# EAGLE design POV_V2 (EAGLE 6.5.0)
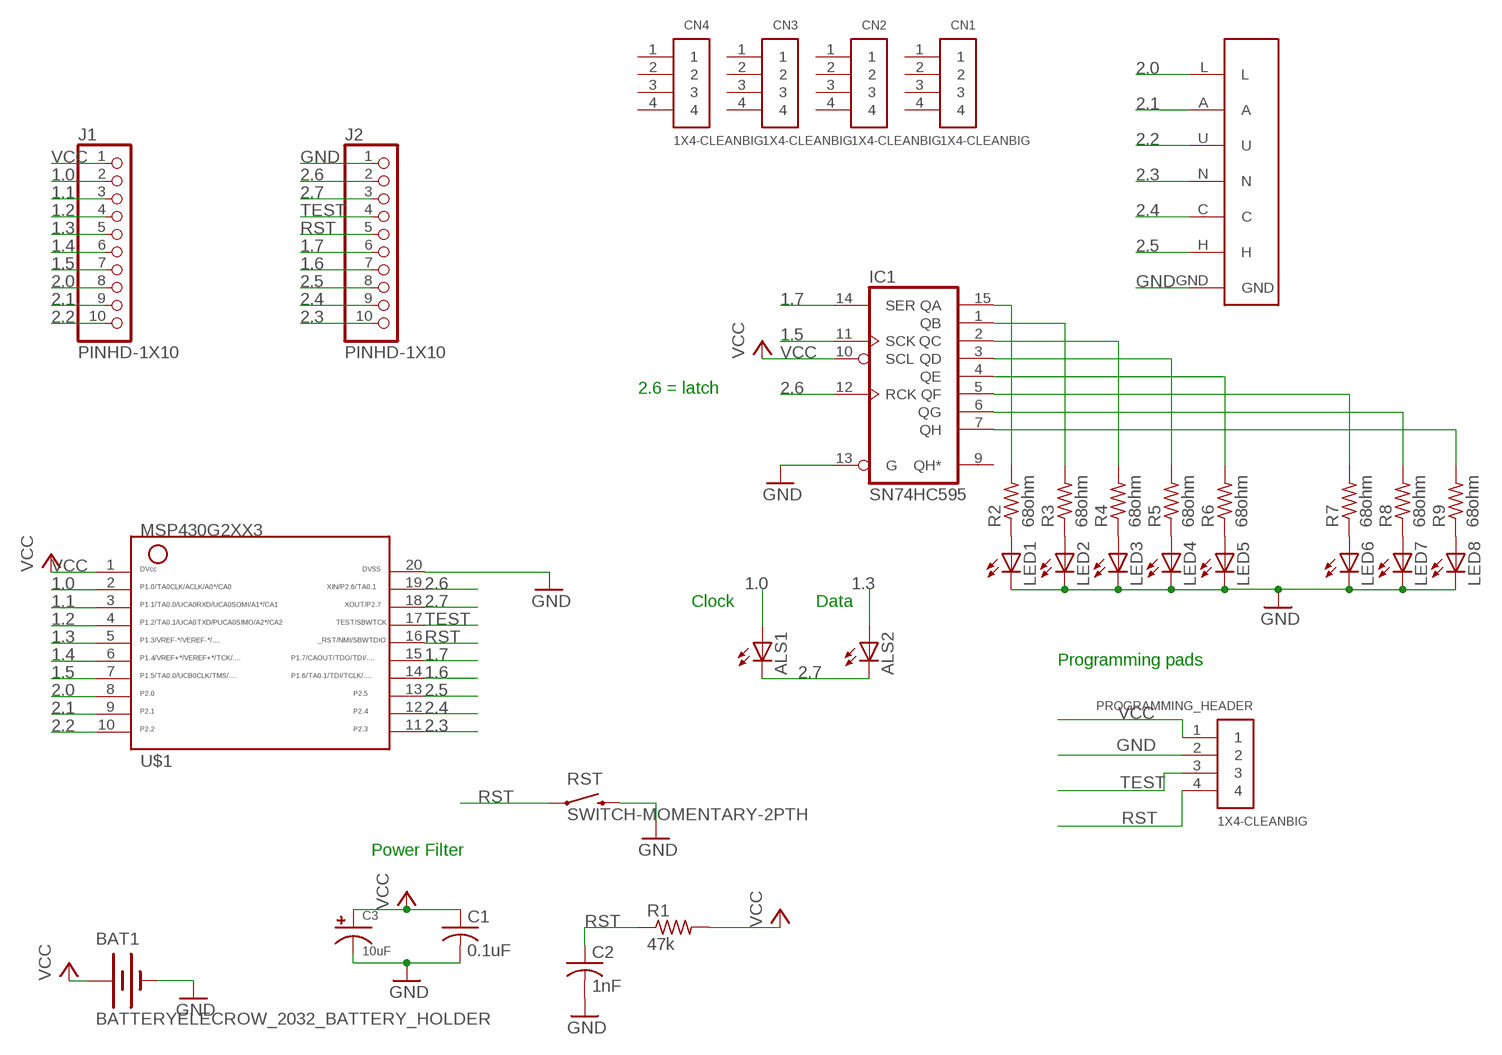
[diagram p0: schematic, sheet 1]

## Parts
ALS1  LED3MM  [LED3MM]
ALS2  LED3MM  [LED3MM]
BAT1  BATTERYELECROW_2032_BATTERY_HOLDER  [BATTCON_20MM_4LEGS]
C1  0.1uF  C-US025-024X044  [C025-024X044]
C2  1nF  C-US025-024X044  [C025-024X044]
C3  10uF  CPOL-US  [E2,5-5]
CN1  1X4-CLEANBIG  [1X04-CLEANBIG]
CN2  1X4-CLEANBIG  [1X04-CLEANBIG]
CN3  1X4-CLEANBIG  [1X04-CLEANBIG]
CN4  1X4-CLEANBIG  [1X04-CLEANBIG]
IC1  SN74HC595  74LS595N  [DIL16]
J1  PINHD-1X10  [1X10-BIG]
J2  PINHD-1X10  [1X10-BIG]
LED1  LED3MM  [LED3MM]
LED2  LED3MM  [LED3MM]
LED3  LED3MM  [LED3MM]
LED4  LED3MM  [LED3MM]
LED5  LED3MM  [LED3MM]
LED6  LED3MM  [LED3MM]
LED7  LED3MM  [LED3MM]
LED8  LED3MM  [LED3MM]
PROGRAMMING_HEADER  1X4-CLEANBIG  [1X04-CLEANBIG]
R1  47k  R-US_0204/7  [0204/7]
R2  68ohm  R-US_0204/7  [0204/7]
R3  68ohm  R-US_0204/7  [0204/7]
R4  68ohm  R-US_0204/7  [0204/7]
R5  68ohm  R-US_0204/7  [0204/7]
R6  68ohm  R-US_0204/7  [0204/7]
R7  68ohm  R-US_0204/7  [0204/7]
R8  68ohm  R-US_0204/7  [0204/7]
R9  68ohm  R-US_0204/7  [0204/7]
RST  SWITCH-MOMENTARY-2PTH  [TACTILE-PTH]
U$1  G2553  G2XX3---N20  [N20]
U$5  LAUNCH_SLIDER  [LAUNCHYOURDESIGN_CAPT_SLIDER]

## Nets
1.0: ALS1.A J1.2 U$1.2
1.1: J1.3 U$1.3
1.2: J1.4 U$1.4
1.3: ALS2.A J1.5 U$1.5
1.4: J1.6 U$1.6
1.5: IC1.11(SCK) J1.7 U$1.7
1.6: J2.7 U$1.14
1.7: IC1.14(SER) J2.6 U$1.15
2.0: J1.8 U$1.8 U$5.L
2.1: J1.9 U$1.9 U$5.A
2.2: J1.10 U$1.10 U$5.U
2.3: J2.10 U$1.11 U$5.N
2.4: J2.9 U$1.12 U$5.C
2.5: J2.8 U$1.13 U$5.H
2.6: IC1.12(RCK) J2.2 U$1.19
2.7: ALS1.K(C) ALS2.K(C) J2.3 U$1.18
GND: BAT1.GND(-) C1.2 C2.2 C3.- IC1.13(G) J2.1 LED1.K(C) LED2.K(C) LED3.K(C) LED4.K(C) LED5.K(C) LED6.K(C) LED7.K(C) LED8.K(C) PROGRAMMING_HEADER.2 RST.3 RST.4 U$1.20 U$5.GND
N$2: LED1.A R2.1
N$3: LED2.A R3.1
N$4: LED3.A R4.1
N$5: LED4.A R5.1
N$6: LED5.A R6.1
N$7: IC1.15(QA) R2.2
N$8: IC1.1(QB) R3.2
N$9: IC1.2(QC) R4.2
N$10: IC1.3(QD) R5.2
N$11: IC1.4(QE) R6.2
N$13: LED6.A R7.1
N$14: LED7.A R8.1
N$15: LED8.A R9.1
N$16: IC1.5(QF) R7.2
N$17: IC1.6(QG) R8.2
N$18: IC1.7(QH) R9.2
RST: C2.1 J2.5 PROGRAMMING_HEADER.4 R1.1 RST.1 RST.2 U$1.16
TEST: J2.4 PROGRAMMING_HEADER.3 U$1.17
VCC: BAT1.VCC1(+) BAT1.VCC2(+) BAT1.VCC3(+) C1.1 C3.+ IC1.10(SCL) J1.1 PROGRAMMING_HEADER.1 R1.2 U$1.1
Unconnected: CN1.1 CN1.2 CN1.3 CN1.4 CN2.1 CN2.2 CN2.3 CN2.4 CN3.1 CN3.2 CN3.3 CN3.4 CN4.1 CN4.2 CN4.3 CN4.4 IC1.9(QH*)

## Notes on the sheet
- 2.6 = latch
- Clock | Data
- Programming pads
- Power Filter

## Power pins joined to a net without a drawn wire
GND: IC1.8(GND)
VCC: IC1.16(VCC)

## Library data of the parts
ALS1 ALS2 LED1-LED8 = led:LED: LED OSRAM: - CHIPLED LG R971, LG N971, LY N971, LG Q971, LY Q971, LO R971, LY R971 LH N974, LH R974 LS Q976, LO Q976, LY Q976 LO Q996 - Hyper CHIPLED LW Q18S LB Q993, LB Q99A, LB R99A - SideLED LS A670, LO A670, LY A670, LG A670, LP A670 LB A673, LV A673, LT A673, LW A673 LH A674 LY A675 LS A676, LA A676, LO A676, LY A676, LW A676 LS A679, LY A679, LG A679 - Hyper Micro SIDELED® LS Y876, LA Y876, LO Y876, LY Y876 LT Y87S - SmartLED LW L88C, LW L88S LB L89C, LB L89S, LG L890 LS L89K, LO L89K, LY L89K LS L896, LA L896, LO L896, LY L896 - TOPLED LS T670, LO T670, LY T670, LG T670, LP T670 LSG T670, LSP T670, LSY T670, LOP T670, LYG T670 LG T671, LOG T671, LSG T671 LB T673, LV T673, LT T673, LW T673 LH T674 LS T676, LA T676, LO T676, LY T676, LB T676, LH T676, LSB T676, LW T676 LB T67C, LV T67C, LT T67C, LS T67K, LO T67K, LY T67K, LW E67C LS E67B, LA E67B, LO E67B, LY E67B, LB E67C, LV E67C, LT E67C LW T67C LS T679, LY T679, LG T679 LS T770, LO T770, LY T770, LG T770, LP T770 LB T773, LV T773, LT T773, LW T773 LH T774 LS E675, LA E675, LY E675, LS T675 LS T776, LA T776, LO T776, LY T776, LB T776 LHGB T686 LT T68C, LB T68C - Hyper Mini TOPLED® LB M676 - Mini TOPLED Santana® LG M470 LS M47K, LO M47K, LY M47K Source: http://www.osram.convergy.de LUXEON: - LUMILED® LXK2-PW12-R00, LXK2-PW12-S00, LXK2-PW14-U00, LXK2-PW14-V00 LXK2-PM12-R00, LXK2-PM12-S00, LXK2-PM14-U00 LXK2-PE12-Q00, LXK2-PE12-R00, LXK2-PE12-S00, LXK2-PE14-T00, LXK2-PE14-U00 LXK2-PB12-K00, LXK2-PB12-L00, LXK2-PB12-M00, LXK2-PB14-N00, LXK2-PB14-P00, LXK2-PB14-Q00 LXK2-PR12-L00, LXK2-PR12-M00, LXK2-PR14-Q00, LXK2-PR14-R00 LXK2-PD12-Q00, LXK2-PD12-R00, LXK2-PD12-S00 LXK2-PH12-R00, LXK2-PH12-S00 LXK2-PL12-P00, LXK2-PL12-Q00, LXK2-PL12-R00 Source: www.luxeon.com KINGBRIGHT: KA-3528ASYC Source: www.kingbright.com
BAT1 = TIBadgeCustom:BATTERY
C1 C2 = rcl:C-US: CAPACITOR, American symbol
C3 = TIBadgeCustom:CPOL-US
CN1-CN4 = adafruit:1X4: 4-pin connector
IC1 = TIBadgeCustom:74*595: 8-bit SHIFT REGISTER, output latch
J1 J2 = adafruit:PINHD-1X10: Pin header 1x10 0.1" spacing With round pins
PROGRAMMING_HEADER = BergCustom:1X4: 4-pin connector
R1 = rcl:R-US_: RESISTOR, American symbol
R2-R9 = resistor:R-US_: RESISTOR, American symbol
RST = Sparkfun:SWITCH-MOMENTARY-2
U$1 = TI_MSP430_v16:G2XX3---N20: MSP430G2XX1 PDIP (N) 20 Pin Package
U$5 = TIBadgeCustom:LAUNCH_SLIDER

## Board
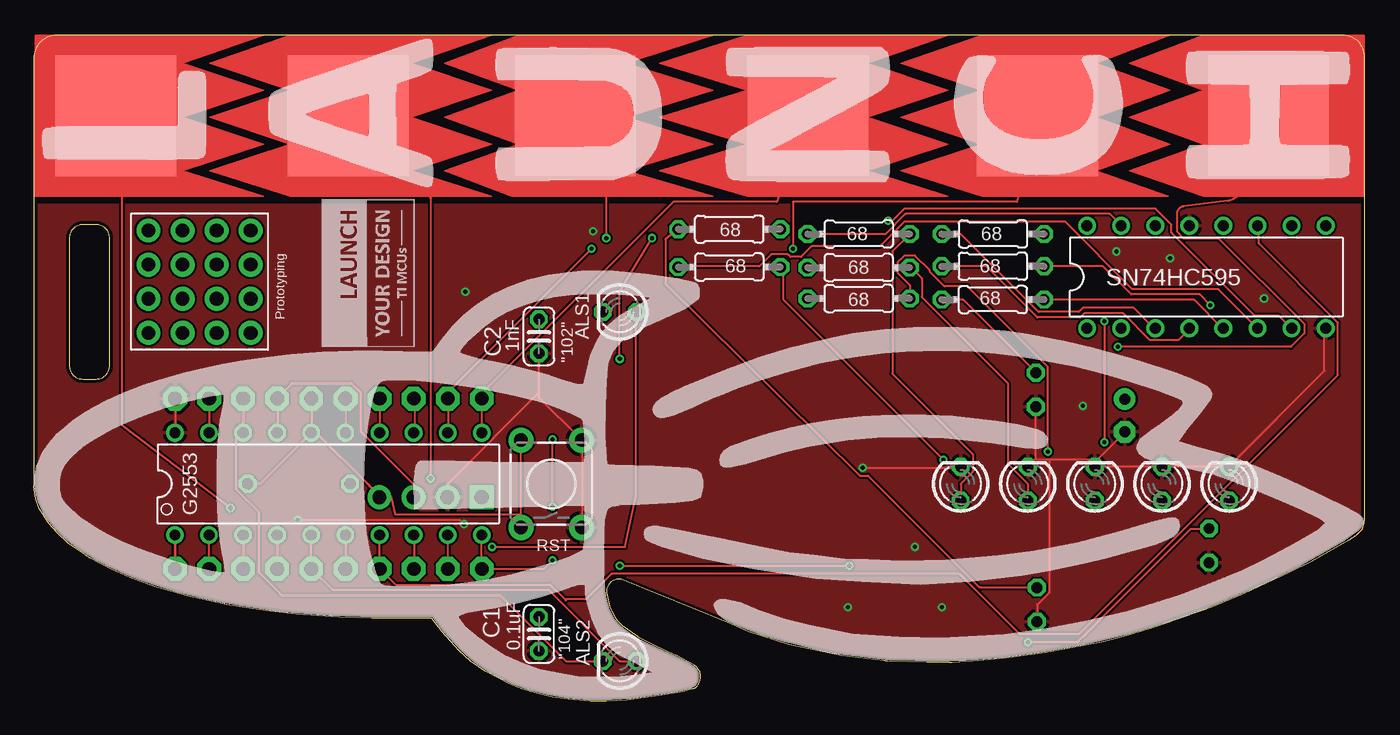
[diagram p1: board, top side]
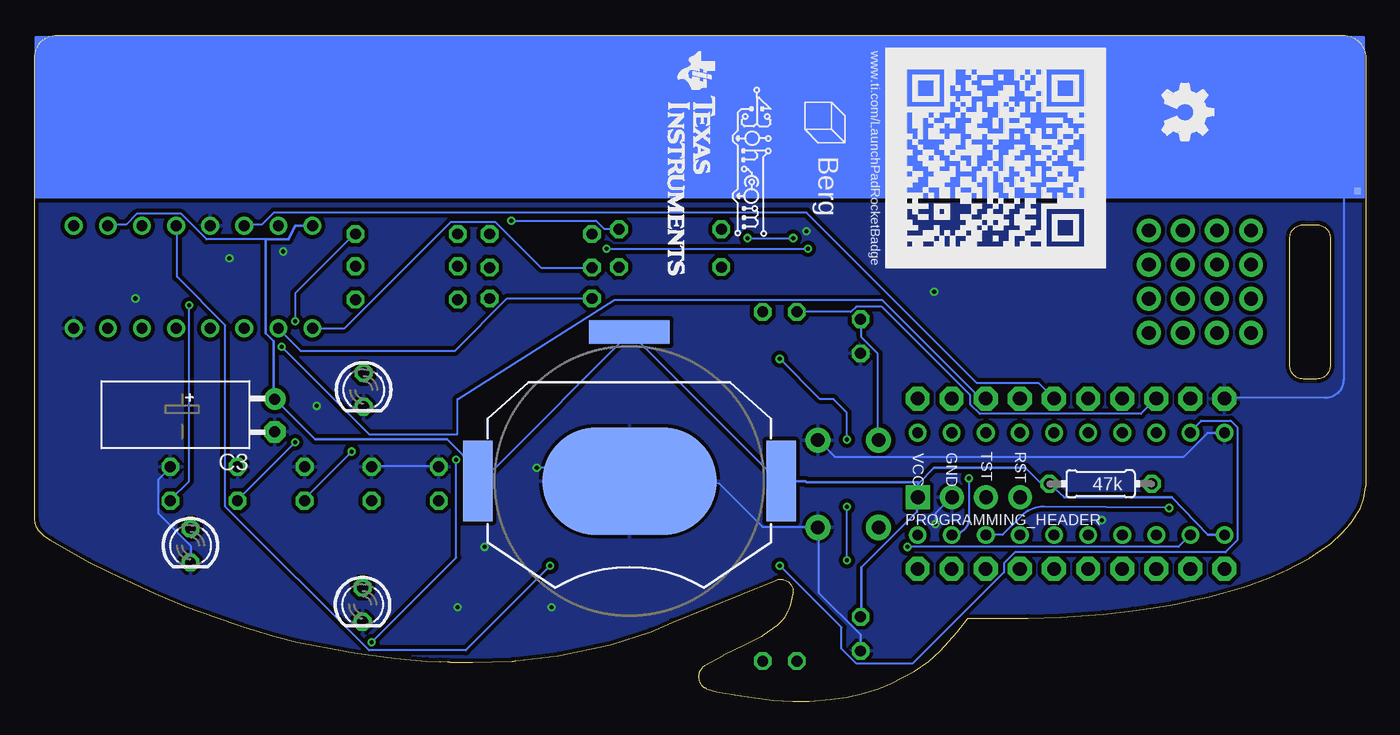
[diagram p2: board, bottom side, seen from below]

Size 99.15 x 49.6 mm. Coordinates in mm from the lower left corner, seen from the top.
Outline: 2.65,34.5 2.65,25 arc90 3.65,24 4.65,24 arc90 5.65,25 5.65,34.5 arc90 4.65,35.5 3.65,35.5 arc90 2.65,34.5
Copper layers (1*16): Top 0.035mm / dielectric 1.5mm / Bottom 0.035mm
Design rules "Elecrow_2-layer_eagle_rule *": minimum track width 6mil, minimum drill 12mil, track to track 6mil, track to pad 6mil, pad to pad 6mil, via to via 6mil, smd to smd 0mil, copper to edge 10mil, drill to drill 10mil, minimum pad ring 10mil, minimum via ring 6mil, stop-mask expansion 2mil, vias tented up to drill 10mm, thermal gap 10mil

### Footprints (pad centres in the part's own frame; a part is rotated, then mirrored left to right if it is on the bottom)
LED3MM = drill 0.813 octagon: A -1.27,0; K 1.27,0
BATTCON_20MM_4LEGS = smd 13 x 8: GND 0,0 | smd 2.2 x 6: VCC1 -11.3,0; VCC2 11.3,0 | smd 6 x 1.778: VCC3 0,-11.1
C025-024X044 = drill 0.813 octagon: 1 -1.27,0; 2 1.27,0
E2,5-5 = drill 0.813 pad 1.6: + 0.005,-1.21 | drill 0.813 pad 1.6 octagon: - 0.005,1.23
1X04-CLEANBIG = drill 1.016 pad 1.778: 1 -3.81,0; 2 -1.27,0; 3 1.27,0; 4 3.81,0
DIL16 = drill 0.813: 1 -8.89,-3.81; 2 -6.35,-3.81; 3 -3.81,-3.81; 4 -1.27,-3.81; 5 1.27,-3.81; 6 3.81,-3.81; 7 6.35,-3.81; 8 8.89,-3.81; 9 8.89,3.81; 10 6.35,3.81; 11 3.81,3.81; 12 1.27,3.81; 13 -1.27,3.81; 14 -3.81,3.81; 15 -6.35,3.81; 16 -8.89,3.81
1X10-BIG = drill 1.016 pad 1.778 octagon: 1 -11.43,0; 2 -8.89,0; 3 -6.35,0; 4 -3.81,0; 5 -1.27,0; 6 1.27,0; 7 3.81,0; 8 6.35,0; 9 8.89,0; 10 11.43,0
1X04-CLEANBIG' = drill 1.016 pad 1.778 square: 1 -3.81,0 | drill 1.016 pad 1.778: 2 -1.27,0; 3 1.27,0; 4 3.81,0
0204/7 = drill 0.813 octagon: 1 -3.81,0; 2 3.81,0
TACTILE-PTH = drill 1.016 pad 1.88: 1 -3.251,2.261; 2 3.251,2.261; 3 -3.251,-2.261; 4 3.251,-2.261
N20 = drill 0.813: 1 -11.435,-3.81; 2 -8.895,-3.81; 3 -6.355,-3.81; 4 -3.815,-3.81; 5 -1.275,-3.81; 6 1.265,-3.81; 7 3.805,-3.81; 8 6.345,-3.81; 9 8.885,-3.81; 10 11.425,-3.81; 11 11.425,3.81; 12 8.885,3.81; 13 6.345,3.81; 14 3.805,3.81; 15 1.265,3.81; 16 -1.275,3.81; 17 -3.815,3.81; 18 -6.355,3.81; 19 -8.895,3.81; 20 -11.435,3.81
LAUNCHYOURDESIGN_CAPT_SLIDER = smd 9 x 9: A 6.1,75.7; C 6.1,24.35; H 6.1,7.13; L 6.1,93; N 6.1,41.43; U 6.1,58.77 | smd 0.5 x 0.5 bottom: GND 0.5,98.5

### Placement (x,y rotation side)
ALS1  43.65,29 180 top
ALS2  43.65,3 180 top
BAT1  54.85,16.4 180 bottom
C1  37.63,5.02 270 top
C2  37.63,27.18 270 top
C3  81.27,21.3 180 bottom
CN1  12.35,32.52 0 top
CN2  12.35,35.06 0 top
CN3  12.35,29.98 0 top
CN4  12.35,27.44 0 top
IC1  87.35,31.6 0 top
J1  21.95,9.86 0 top
J2  21.95,22.54 0 top
LED1  69.05,16.2 90 top
LED2  74.05,16.2 90 top
LED3  79.05,16.2 90 top
LED4  84.05,16.2 90 top
LED5  89.05,16.2 90 top
LED6  74.65,23.2 270 bottom
LED7  87.55,11.6 270 bottom
LED8  74.73,7.2 270 bottom
PROGRAMMING_HEADER  1X4-CLEANBIG  [1X04-CLEANBIG']  29.55,15.2 0 bottom
R1  19.75,16.2 180 bottom
R2  61.45,34.8 180 top
R3  61.45,32.3 180 top
R4  61.45,30 180 top
R5  71.45,34.8 180 top
R6  71.45,32.4 180 top
R7  71.45,29.92 0 top
R8  51.81,32.34 180 top
R9  51.81,35.16 0 top
RST  38.55,16.2 90 top
U$1  21.95,16.2 0 top
U$2  [ROCKET_WIDER_V3]  99.55,0.6 90 top
U$3  [OSHW_FILLX150_NOTEXT]  15.15,46 270 bottom
U$4  [TI_BADGE_QR]  35.75,48.64 270 bottom
U$5  99.11,37.5 90 top
U$6  [LAUNCH_CIRCUIT_OVERLAY]  99.15,37.5 90 top
U$7  [BERG_TI_SILK]  40.29,40.6 270 bottom
U$8  [43OH_CIRCUIT_LOGO_LONG]  45.37,40.14 270 bottom
U$9  [LYD_FULL]  28.35,26.4 90 top
U$10  [LOGO16_TPLACE]  52.15,48.5 270 bottom

### Tracks (layer width: path | path; a pad name or v marks a point on that pad's centre or on a via)
1.0  (via drill 0.3)
  Top 0.152: U$1.2 13.05,12.3 13.05,9.9 J1.2 | v34.15,11.5 44.05,11.5 44.85,15.3 44.85,29 ALS1.A
  Bottom 0.152: v34.15,11.5 13.95,11.5 13.15,12.3 U$1.2
1.1
  Top 0.152: U$1.3 15.65,12.3 15.65,9.9 J1.3
1.2
  Top 0.152: U$1.4 18.15,12.3 18.15,9.9 J1.4
1.3
  Top 0.152: U$1.5 20.65,12.3 20.65,9.9 J1.5 20.75,9.8 22.25,8.3 38.35,8.3 43.65,3 ALS2.A
1.4
  Top 0.152: U$1.6 23.25,12.3 23.25,9.9 J1.6
1.5
  Top 0.152: U$1.7 25.75,12.3 25.75,9.9 J1.7 25.85,9.8 26.95,8.7 38.45,8.7 39.6,7.55 | 39.6,7.55 39.65,7.5 | IC1.11 91.25,35.4 91.25,34.1 97.15,28.2 97.15,24.3 77.85,5 73.45,5 68.95,9.5 43.05,9.5 41.15,7.6 39.65,7.6 39.6,7.55
1.6
  Top 0.152: U$1.14 25.75,20.1 25.75,22.5 J2.7
1.7
  Top 0.152: U$1.15 23.25,20.1 23.25,22.5 J2.6
  Bottom 0.152: IC1.14 83.45,35.5 82.25,35.5 81.35,36.4 41.65,36.4 28.95,23.7 24.35,23.7 23.25,22.6 J2.6
2.0  (via drill 0.3)
  Top 0.152: U$1.8 28.35,12.3 28.35,9.9 J1.8 | v14.65,14.4 6.55,20.6 6.55,43.7 U$5.L
  Bottom 0.152: v14.65,14.4 23.96,14.5 arc-45 25.65,13.8 27.05,12.4 28.25,12.4 U$1.8
2.1  (via drill 0.3)
  Top 0.152: U$1.9 30.85,12.3 30.85,9.9 J1.9 | v29.55,16.6 29.55,37.5 23.45,43.6 U$5.A
  Bottom 0.152: v29.55,16.6 29.55,13.69 arc90 U$1.9
2.2  (via drill 0.3)
  Top 0.152: U$1.10 33.35,12.3 33.35,9.9 J1.10 38.01,9.86 v38.65,10.5 | v38.65,14.5 v38.65,19.5 | v43.65,25.5 43.65,30.5 v46.05,34.5 | v42.65,34.5 42.65,41.29 U$5.U
  Bottom 0.152: v38.65,10.5 v38.65,14.5 | v38.65,19.5 38.65,21.5 39.65,22.5 40.65,22.5 v43.65,25.5 | v46.05,34.5 v42.65,34.5
2.3
  Top 0.152: U$1.11 33.35,20.1 33.35,22.5 J2.10 33.45,22.6 33.45,23 47.65,37.2 55.35,37.2 57.65,43.6 U$5.N
2.4  (via drill 0.3)
  Top 0.152: U$1.12 30.85,20.1 30.85,22.5 J2.9 30.85,22.6 30.85,23 v41.55,33.7 | v56.55,33.7 56.55,37.2 73.25,37.2 U$5.C
  Bottom 0.152: v56.55,33.7 v41.55,33.7
2.5  (via drill 0.3)
  Top 0.152: U$1.13 28.35,20.1 28.35,22.5 J2.8 | v80.75,26.4 93.65,26.4 94.65,27.4 94.65,28.1 88.25,34.5 85.65,34.5 85.15,35 85.15,36.28 arc-83 85.66,36.86 88.95,37.27 arc83 89.95,38.41 89.95,43.6 U$5.H
  Bottom 0.152: v80.75,26.4 74.25,19.9 67.65,19.9 67.65,22.5 55.95,29.9 36.05,29.9 28.75,22.6 28.35,22.6 J2.8
2.6  (via drill 0.3)
  Top 0.152: U$1.19 13.05,20.1 13.05,22.5 J2.2 | v43.65,10.1 v60.75,10.1
  Bottom 0.152: IC1.12 88.55,35.4 88.55,31.6 84.95,28 84.95,14.5 74.25,3.8 67.05,3.8 v60.75,10.1 | U$1.19 13.05,20.1 12.25,20.9 10.05,20.9 9.55,20.4 9.55,12 10.45,11.1 26.15,11.1 26.95,10.3 26.95,9.6 33.75,2.8 37.95,2.8 39.05,3.9 39.05,5.5 v43.65,10.1
2.7
  Top 0.152: ALS2.K 39.65,3 34.75,7.9 18.45,7.9 16.75,9.6 16.75,14.1 15.05,15.8 15.05,19.5 15.55,20 U$1.18 15.65,20.1 15.65,22.5 J2.3
  Bottom 0.152: ALS1.K 38.35,29 37.95,29.4 36.05,29.4 29.45,22.8 29.45,22.1 28.75,21.4 16.75,21.4 15.65,22.5 J2.3
GND  (via drill 0.3)
  Top 0.152: LED6.K 74.65,18.1 74.6,18.05 | 74.6,18.05 74.05,17.5 LED2.K | 79.05,17.5 79.05,17.8 81.25,20 C3.- | 79.05,17.5 84.05,17.5 | 79.05,17.5 LED3.K 79.15,18 75.65,18 | 84.05,17.5 89.05,17.5 | 84.05,17.5 LED4.K | 89.05,17.5 96.15,24.6 96.15,27.7 IC1.8 | 89.05,17.5 LED5.K | 75.65,18 74.65,18 74.6,18.05 | U$1.20 10.55,20.1 10.55,22.5 J2.1 | 37.65,23 37.65,22.6 40.75,19.5 RST.4 40.85,19.4 40.85,13 RST.3 | 37.65,23 37.65,25.9 C2.2 | 37.65,23 30.85,16.2 PROGRAMMING_HEADER.2 | v61.75,17.4 69.05,17.4 LED1.K | 75.65,18 75.65,8.1 74.75,7.2 74.75,6 LED8.K | v19.65,13.5 31.75,13.5 v32.05,13.2
  Bottom 0.152: J2.1 10.45,22.6 2.99,22.6 arc-90 1.65,23.95 1.65,38 U$5.GND | C1.2 37.65,3.8 37.65,5 40.75,8.1 40.75,12.9 RST.3 40.85,13 44.95,13 48.15,16.2 BAT1.GND 56.15,17.4 v61.75,17.4 | U$1.20 10.55,20 11.75,20 13.55,18.2 39.55,18.2 40.75,19.4 RST.4 40.85,19.5 | LED7.K 87.55,11.6 89.95,14 89.95,16.5 89.05,17.4 LED5.K | v32.05,13.2 32.05,14 30.85,15.2 PROGRAMMING_HEADER.2 | LED2.K 74.05,17.5 69.05,17.5 LED1.K
  other vias: 32.15,30.5 60.65,7 67.65,7 65.65,11.5 91.65,30 78.15,22 41.65,35 80.65,33.5 84.65,33
  pour Top: -6.35,37 103.15,37 102.15,-1 -2.35,-1 -2.35,2.5 -6.35,0
  pour Bottom (isolate 0.3): -3.35,37.5 100.65,37.5 100.65,-1.5 -1.35,-1.5 -1.35,3.5
N$2
  Top 0.152: LED1.A 69.05,16.2 69.95,17.1 69.95,18.4 63.95,24.4 63.95,33.5 R2.1
N$3
  Top 0.152: 74.05,14.9 LED2.A 74.05,16.2 72.55,17.7 72.55,23.7 66.15,30.1 66.15,31.5 65.35,32.3 R3.1
N$4  (via drill 0.3)
  Top 0.152: v75.55,18.6 75.55,24.9 69.55,30.9 67.85,30.9 66.75,32 66.75,32.1 65.65,33.2 64.85,33.2 64.35,32.7 64.35,31.9 65.25,31 R4.1
  Bottom 0.152: v75.55,18.6 79.05,15.1 LED3.A
N$5  (via drill 0.3)
  Top 0.152: v79.75,28.3 v79.75,19.3
  Bottom 0.152: v79.75,19.3 84.05,15 LED4.A | v79.75,28.3 79.75,30.4 75.35,34.8 R5.1
N$6  (via drill 0.3)
  Top 0.152: R6.1 79.65,32.4 81.75,30.3 86.85,30.3 v87.65,29.5
  Bottom 0.152: v87.65,29.5 87.65,16.4 89.05,15 LED5.A
N$7
  Top 0.152: R2.2 63.45,34.8 64.95,36.3 80.15,36.3 80.95,35.5 IC1.15
N$8
  Bottom 0.152: R3.2 61.45,32.3 64.85,35.7 68.15,35.7 76.05,27.8 IC1.1
N$9
  Bottom 0.152: R4.2 63.95,30 67.85,26.1 79.35,26.1 80.95,27.7 IC1.2
N$10
  Top 0.152: R5.2 69.05,34.8 74.85,29 77.85,29 78.15,29.3 81.95,29.3 83.45,27.8 IC1.3
N$11
  Top 0.152: R6.2 70.95,32.4 74.75,28.6 77.95,28.6 78.25,28.9 81.15,28.9 83.15,26.9 85.25,26.9 86.05,27.7 IC1.4
N$13
  Top 0.152: R7.1 67.65,29.9 69.25,29.9 74.65,24.5 LED6.A
N$14  (via drill 0.3)
  Top 0.152: v67.75,18 55.85,29.9 55.85,32.3 R8.1 | v74.05,4.4 77.75,4.4 86.15,12.8 87.55,12.8 LED7.A
  Bottom 0.152: v67.75,18 67.75,10.7 v74.05,4.4
N$15
  Top 0.152: LED8.A 74.65,8.5 70.45,8.5 62.15,16.8 61.55,16.8 47.05,31.1 47.05,34.4 47.95,35.1 R9.1
N$16
  Top 0.152: R7.2 75.35,29.9 86.45,29.9 88.55,27.8 IC1.5
N$17
  Top 0.152: IC1.6 88.25,30.7 81.85,30.7 76.85,35.7 64.85,35.7 63.05,33.9 57.95,33.9 57.15,33.1 56.35,33.1 56.15,33.3 54.95,33.3 54.05,32.4 48.25,32.4 R8.2
N$18  (via drill 0.3)
  Top 0.152: v63.65,35.8 63.95,35.8 64.85,36.7 83.55,36.7 84.75,35.5 84.75,34.9 90.95,28.7 92.75,28.7 93.65,27.8 IC1.7
  Bottom 0.152: v63.65,35.8 57.35,35.8 56.75,35.2 55.65,35.2 R9.2
RST
  Top 0.152: R1.1 16.85,16.2 20.65,20 U$1.16 | U$1.16 20.75,20 21.05,20 24.85,16.2 PROGRAMMING_HEADER.4 26.65,15.2 26.95,13.9 36.25,13.9 | J2.5 20.75,22.5 20.75,20.1 U$1.16 | 36.25,13.9 36.25,19.4 RST.2 | 36.25,13.9 36.25,13 RST.1
  Bottom 0.152: C2.1 37.55,28.4 37.55,27.1 36.35,25.9 36.35,19.5 RST.2
TEST
  Top 0.152: U$1.17 18.15,20.1 18.15,22.5 J2.4 18.15,22.6 19.25,23.7 23.65,23.7 24.35,23 24.35,20.1 28.25,16.2 PROGRAMMING_HEADER.3
VCC
  Top 0.152: 10.55,12.3 U$1.1 | 10.55,9.9 J1.1
  Top 0.2: 10.55,9.9 10.55,12.3
  Bottom 0.152: 78.55,35.4 IC1.16 | 81.35,22.6 C3.+ 81.25,22.5 | 24.15,16.2 R1.2 | 33.35,16.2 33.3,16.25 33.35,16.3 | 10.55,12.4 U$1.1 | 37.55,6.3 C1.1 | 33.45,15.2 PROGRAMMING_HEADER.1 | 66.15,17.2 BAT1.VCC2 66.15,17.3 64.95,17.3 | 41.65,16.3 41.75,16.4 | 43.75,16.4 BAT1.VCC1 | 54.85,27.4 BAT1.VCC3 | 81.95,34.4 86.35,34.4 88.25,36.3 91.55,36.3 92.35,35.5 93.65,35.5 IC1.10
  Bottom 0.2: 78.55,35.4 79.75,35.4 80.25,34.4 81.95,34.4 81.95,27.4 81.35,26.8 81.35,22.6 | 24.15,16.2 25.35,17.4 32.15,17.4 33.3,16.25 | 33.35,16.2 PROGRAMMING_HEADER.1 | 10.55,12.4 11.75,12.4 14.45,15.2 22.45,15.2 R1.2 | 37.55,6.3 37.55,10 33.45,14.1 33.45,15.2 | 41.65,16.3 33.35,16.3 | 66.15,17.2 68.45,19.5 78.25,19.5 81.25,22.5 | 41.75,16.4 BAT1.VCC1 | BAT1.VCC3 43.75,16.4 | 54.85,27.4 64.95,17.3

### Text on the board
tPlace: 68 | 68 | 68 | 68 | 68 | 68 | 68 | 68 | Prototyping | "102" | "104"
Document: Fix TI logo on bottom - needs to be a polygon